# Altium schematic sheet eyes_hvac_v1_pcb.SchDoc
size 381 x 241 mm; SheetNumber: 1; SheetTotal: 1
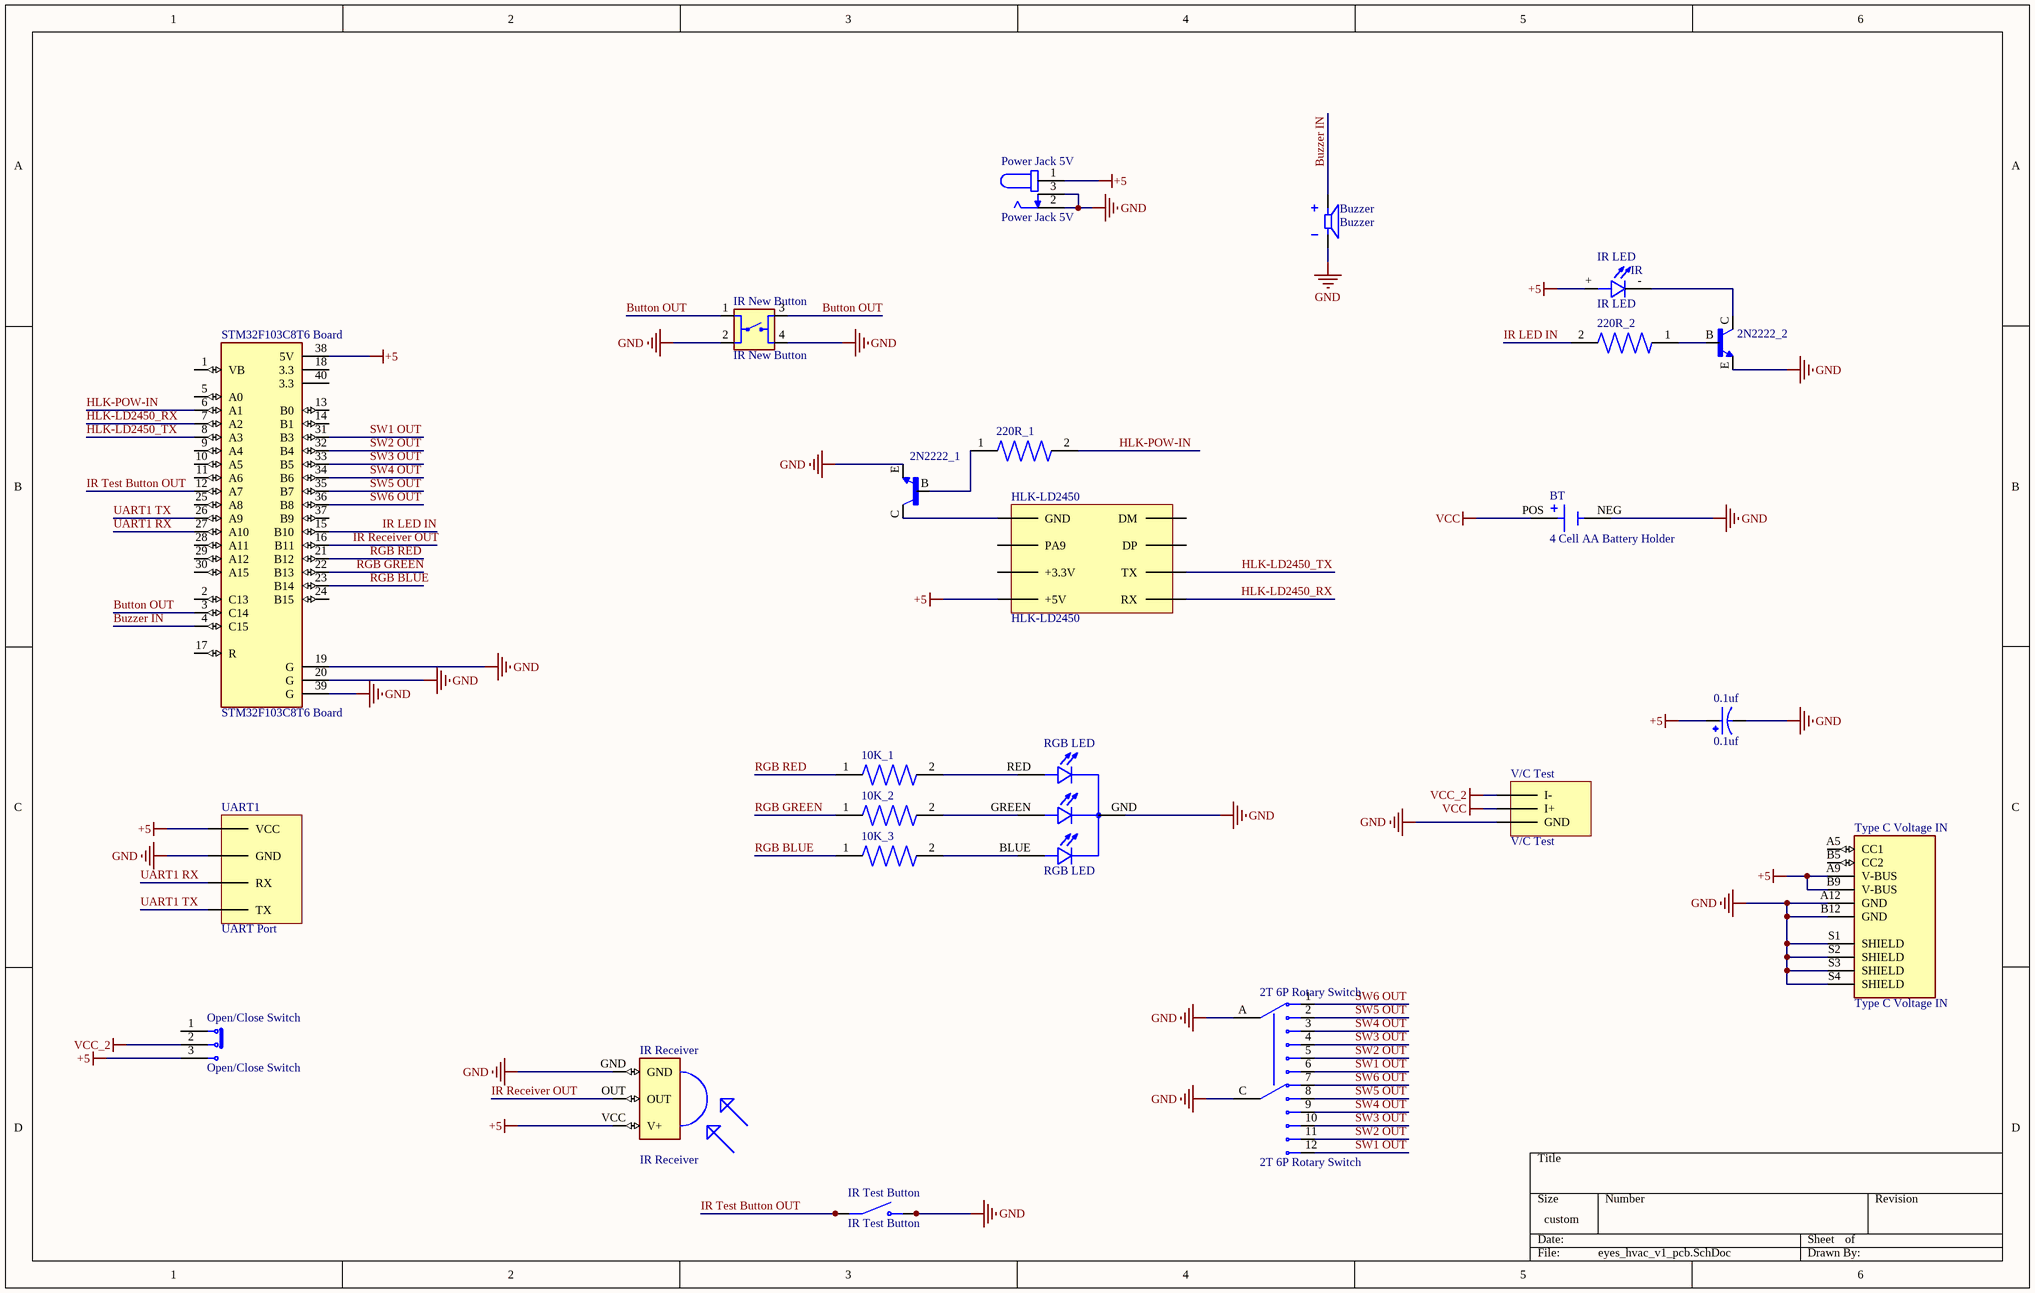
[diagram p0: eyes_hvac_v1_pcb.SchDoc]

## Parts
0.1uf  0.1uf  [CAP 0.1UF]
2N2222_1  2N2222  [2N2222]  (value not drawn)
2N2222_2  2N2222  [2N2222]  (value not drawn)
2T_6P_Rotary_Switch  2T 6P Rotary Switch  [2POL 6POS Rotary Switch]
10K_1  10K RES  [RES]  (value not drawn)
10K_2  10K RES  [RES]  (value not drawn)
10K_3  10K RES  [RES]  (value not drawn)
220R_1  220R RES  [RES]  (value not drawn)
220R_2  220R RES  [RES]  (value not drawn)
BT  4 Cell AA Battery Holder  [4 CELL AA BATTERY HOLDER]
Buzzer  Buzzer  [Buzzer]
HLK-LD2450  HLK-LD2450  [HLK-LD2450]
IR_LED  IR LED  [IR LED]
IR_New_Button  IR New Button  [IR New Button]
IR_Receiver  IR Receiver  [IR Receiver]
IR_Test_Button  IR Test Button  [IR Test Button]
Open/Close_Switch  Open/Close Switch  [Open/Close Switch]
Power_Jack_5V  Power Jack 5V  [Power Jack]
RGB_LED  RGB LED  [RGB LED]
STM32F103C8T6_Board  STM32F103C8T6 Board  [STM32F103C8T6 Board]
Type_C_Voltage_IN  Type C Voltage IN  [Type C Voltage IN]
UART1  UART Port  [UART Port]
V/C_Test  V/C Test  [V/C TEST]

## Nets
+5: 0.1uf.P HLK-LD2450.+5V IR_LED.+ IR_Receiver.VCC(V+) Open/Close_Switch.3 Power_Jack_5V.1 STM32F103C8T6_Board.38(5V) Type_C_Voltage_IN.A9(V-BUS) Type_C_Voltage_IN.B9(V-BUS) UART1.VCC
GND: 0.1uf.N 2N2222_1.E 2N2222_2.E 2T_6P_Rotary_Switch.A 2T_6P_Rotary_Switch.C BT.NEG Buzzer.N IR_New_Button.2 IR_New_Button.4 IR_Receiver.GND IR_Test_Button.3(NO) IR_Test_Button.4(NO) Power_Jack_5V.2 Power_Jack_5V.3 RGB_LED.GND STM32F103C8T6_Board.19(G) STM32F103C8T6_Board.20(G) STM32F103C8T6_Board.39(G) Type_C_Voltage_IN.A12(GND) Type_C_Voltage_IN.B12(GND) Type_C_Voltage_IN.S1(SHIELD) Type_C_Voltage_IN.S2(SHIELD) Type_C_Voltage_IN.S3(SHIELD) Type_C_Voltage_IN.S4(SHIELD) UART1.GND V/C_Test.GND
VCC: BT.POS V/C_Test.VCC(I+)
VCC_2: Open/Close_Switch.2 V/C_Test.VCC_2(I-)
Button OUT: IR_New_Button.1 IR_New_Button.3 STM32F103C8T6_Board.3(C14)
Buzzer IN: Buzzer.P STM32F103C8T6_Board.4(C15)
HLK-LD2450_RX: HLK-LD2450.RX STM32F103C8T6_Board.7(A2)
HLK-LD2450_TX: HLK-LD2450.TX STM32F103C8T6_Board.8(A3)
HLK-POW-IN: 220R_1.2 STM32F103C8T6_Board.6(A1)
IR LED IN: 220R_2.2 STM32F103C8T6_Board.15(B10)
IR Receiver OUT: IR_Receiver.OUT STM32F103C8T6_Board.16(B11)
IR Test Button OUT: IR_Test_Button.1(COM) IR_Test_Button.2(COM) STM32F103C8T6_Board.12(A7)
RGB BLUE: 10K_3.1 STM32F103C8T6_Board.23(B14)
RGB GREEN: 10K_2.1 STM32F103C8T6_Board.22(B13)
RGB RED: 10K_1.1 STM32F103C8T6_Board.21(B12)
SW1 OUT: 2T_6P_Rotary_Switch.6 2T_6P_Rotary_Switch.12 STM32F103C8T6_Board.31(B3)
SW2 OUT: 2T_6P_Rotary_Switch.5 2T_6P_Rotary_Switch.11 STM32F103C8T6_Board.32(B4)
SW3 OUT: 2T_6P_Rotary_Switch.4 2T_6P_Rotary_Switch.10 STM32F103C8T6_Board.33(B5)
SW4 OUT: 2T_6P_Rotary_Switch.3 2T_6P_Rotary_Switch.9 STM32F103C8T6_Board.34(B6)
SW5 OUT: 2T_6P_Rotary_Switch.2 2T_6P_Rotary_Switch.8 STM32F103C8T6_Board.35(B7)
SW6 OUT: 2T_6P_Rotary_Switch.1 2T_6P_Rotary_Switch.7 STM32F103C8T6_Board.36(B8)
UART1 RX: STM32F103C8T6_Board.27(A10) UART1.RX
UART1 TX: STM32F103C8T6_Board.26(A9) UART1.TX
Net2N2222_1_B: 2N2222_1.B 220R_1.1
Net2N2222_1_C: 2N2222_1.C HLK-LD2450.GND
Net2N2222_2_B: 2N2222_2.B 220R_2.1
Net2N2222_2_C: 2N2222_2.C IR_LED.-
Net10K_1_2: 10K_1.2 RGB_LED.RED
Net10K_2_2: 10K_2.2 RGB_LED.GREEN
Net10K_3_2: 10K_3.2 RGB_LED.BLUE

Not connected (* = marked no-connect by the designer): HLK-LD2450 +3.3V DM DP PA9; Open/Close_Switch 1; STM32F103C8T6_Board 1(VB) 2(C13) 5(A0) 9(A4) 10(A5) 11(A6) 13(B0) 14(B1) 17(R) 18(3.3) 24(B15) 25(A8) 28(A11) 29(A12) 30(A15) 37(B9) 40(3.3); Type_C_Voltage_IN A5(CC1) B5(CC2)

## Notes on the sheet
- (in symbol IR LED) IR

## Library data of the parts
0.1uf = 0.1uf: CAP ALUM 33UF 20% 100V THRU HOLE; MF: Panasonic; MP: EEUFS2A330B; Value: *; Check_prices: https://www.snapeda.com/parts/EEUFS2A330B/Panasonic/view-part/5795625/?ref=eda; Price: None; SnapEDA_Link: https://www.snapeda.com/parts/EEUFS2A330B/Panasonic/view-part/5795625/?ref=snap; Availability: In Stock; Package: RADIAL-2 Panasonic
2N2222_1 2N2222_2 = 2N2222: Bipolar (BJT) Transistor NPN 40 V 600 mA 250MHz 625 mW Through Hole TO-92; MF: Diotec Semiconductor; MP: 2N2222A; Package: TO-92-3 Diotec; Check_prices: https://www.snapeda.com/parts/2N2222A/Diotec/view-part/?ref=eda; Value: *; Purchase-URL: https://pricing.snapeda.com/search/part/2N2222A/?ref=eda; Availability: In Stock; SnapEDA_Link: https://www.snapeda.com/parts/2N2222A/Diotec/view-part/?ref=snap; Price: None
2T_6P_Rotary_Switch = 2T 6P Rotary Switch: MP: KC26A30.001NPS; Availability: Unavailable; Package: None; Price: None; Value: *
10K_1-10K_3 = 10K RES: 220 Ohms Â±5% 0.25W, 1/4W Through Hole Resistor Axial - Carbon Film; MF: TE Connectivity; MP: 3-1623927-1; Price: None; SnapEDA_Link: https://www.snapeda.com/parts/3-1623927-1/TE+Connectivity/view-part/?ref=snap; Check_prices: https://www.snapeda.com/parts/3-1623927-1/TE+Connectivity/view-part/?ref=eda; Value: *; Package: None; Availability: In Stock
220R_1 220R_2 = 220R RES: 220 Ohms Â±5% 0.25W, 1/4W Through Hole Resistor Axial - Carbon Film; MF: TE Connectivity; MP: 3-1623927-1; Price: None; SnapEDA_Link: https://www.snapeda.com/parts/3-1623927-1/TE+Connectivity/view-part/?ref=snap; Check_prices: https://www.snapeda.com/parts/3-1623927-1/TE+Connectivity/view-part/?ref=eda; Value: *; Package: None; Availability: In Stock
BT = 4 Cell AA Battery Holder: BATTERY HOLDER AA 4 CELL SMD TAB; MP: BC4AAB; MF: MPD; Package: None; Availability: Warning; Value: *; Price: None; DigiKey-Purchase-URL: https://snapeda.com/shop?store=DigiKey&id=4389075; SnapEDA_Link: https://www.snapeda.com/parts/BC4AAB/MPD/view-part/4389075/?ref=snap
Buzzer = Buzzer: 12 mm, 12 Vdc, 85 dB, Through Hole, Driving Circuit, Magnetic Audio Indicator Buzzer; MF: CUI Devices; MP: CMI-1295-1285T; Check_prices: https://www.snapeda.com/parts/CMI-1295-1285T/CUI+Devices/view-part/?ref=eda; Digi-Key_Part_Number: 102-CMI-1295-1285T-ND; Value: *; Package: CUI Inc.; SnapEDA_Link: https://www.snapeda.com/parts/CMI-1295-1285T/CUI+Devices/view-part/?ref=snap; Purchase-URL: https://pricing.snapeda.com/search/part/CMI-1295-1285T/?ref=eda; CUI_purchase_URL: https://www.cuidevices.com/product/audio/buzzers/audio-indicators/cmi-1295-1285t?utm_source=snapeda.com&utm_medium=referral&utm_campaign=snapedaBOM
IR_LED = IR LED: Infrared _IR_ Emitter 940nm 1.35V 100mA 40mW/sr @ 100mA 34Â° Radial, 5mm Dia _T 1 3/4_; MP: TSAL6200; MF: Vishay; Price: None; SnapEDA_Link: https://www.snapeda.com/parts/TSAL6200/Vishay%20Semiconductor%20Opto%20Division/view-part/1186623/?ref=snap; Package: Radial Vishay; Availability: Unavailable; Value: *
IR_New_Button = IR New Button: Tactile Switch SPST-NO Top Actuated Through Hole; MP: FSM8JH; MF: TE Connectivity; Check_prices: https://www.snapeda.com/parts/FSM8JH/TE+Connectivity+ALCOSWITCH+Switches/view-part/?ref=eda; Value: *; Availability: In Stock; Price: None; Package: None; SnapEDA_Link: https://www.snapeda.com/parts/FSM8JH/TE+Connectivity+ALCOSWITCH+Switches/view-part/?ref=snap
IR_Receiver = IR Receiver: IR Receiver and Demodulator; MP: TSOP1838; Value: *; Package: None; Availability: Unavailable; Price: None
IR_Test_Button = IR Test Button: Switch Tactile OFF (ON) SPST Extended Square Button PC Pins 0.05A 12VDC 2.55N Thru-Hole Loose Piece; MF: TE Connectivity / AMP; MP: 1571627-1; Value: *; SnapEDA_Link: https://www.snapeda.com/parts/1571627-1/TE+Connectivity+%252F+AMP/view-part/?ref=snap; EU_RoHS_Compliance: Compliant; Availability: In Stock; Price: None; Package: None; Check_prices: https://www.snapeda.com/parts/1571627-1/TE+Connectivity+%252F+AMP/view-part/?ref=eda
Open/Close_Switch = Open/Close Switch: Slide Switch SPDT Through Hole; MP: 1825159-1; Configuration_Pole-Throw: Single Pole - Double Throw; Contact_Current_Rating: .25 A; MF: TE Connectivity; Value: *; SnapEDA_Link: https://www.snapeda.com/parts/1825159-1/TE+Connectivity+ALCOSWITCH+Switches/view-part/?ref=snap; Switch_Type: Slide; Purchase-URL: https://pricing.snapeda.com/search/part/1825159-1/?ref=eda; Check_prices: https://www.snapeda.com/parts/1825159-1/TE+Connectivity+ALCOSWITCH+Switches/view-part/?ref=eda; Availability: In Stock; EU_RoHS_Compliance: Compliant; Price: None; Package: None
Power_Jack_5V = Power Jack: 2.0 x 6.5 mm, 2.5 A, Horizontal, Through Hole, Dc Power Jack Connector; MP: PJ-002A; MF: CUI Devices; Check_prices: https://www.snapeda.com/parts/PJ-002A/CUI+Devices/view-part/?ref=eda; Availability: In Stock; CUI_purchase_URL: https://www.cuidevices.com/product/interconnect/connectors/dc-power-connectors/jacks/pj-002a?utm_source=snapeda.com&utm_medium=referral&utm_campaign=snapedaBOM; SnapEDA_Link: https://www.snapeda.com/parts/PJ-002A/CUI+Devices/view-part/?ref=snap; Purchase-URL: https://pricing.snapeda.com/search/part/PJ-002A/?ref=eda; Price: None; Package: None; Value: *
RGB_LED = RGB LED: Red, Green, Blue (RGB) - LED Indication - Discrete 2.1V Red, 3.2V Green, 3.2V Blue Radial; MF: NTE Electronics, Inc; MP: NTE30155; Purchase-URL: https://pricing.snapeda.com/search/part/NTE30155/?ref=eda; SnapEDA_Link: https://www.snapeda.com/parts/NTE30155/NTE+Electronics/view-part/?ref=snap; Price: None; Package: Radial NTE Electronics; Value: *; Check_prices: https://www.snapeda.com/parts/NTE30155/NTE+Electronics/view-part/?ref=eda; Availability: In Stock
STM32F103C8T6_Board = STM32F103C8T6 Board: STM32F103C8T6 ARM STM32 Minimum System Development Board Module For Arduino; MP: ZC323000; Package: None; Value: *; Availability: Unavailable; Price: None
Type_C_Voltage_IN = Type C Voltage IN: Type C, 3 A, Right Angle, Surface Mount (SMT), Power-Only USB Receptacle; MP: UJC-HP-3-SMT-TR; Value: *; Availability: Unavailable; Price: None; Package: None